# Altium schematic sheet RS485.SchDoc
size A4 portrait
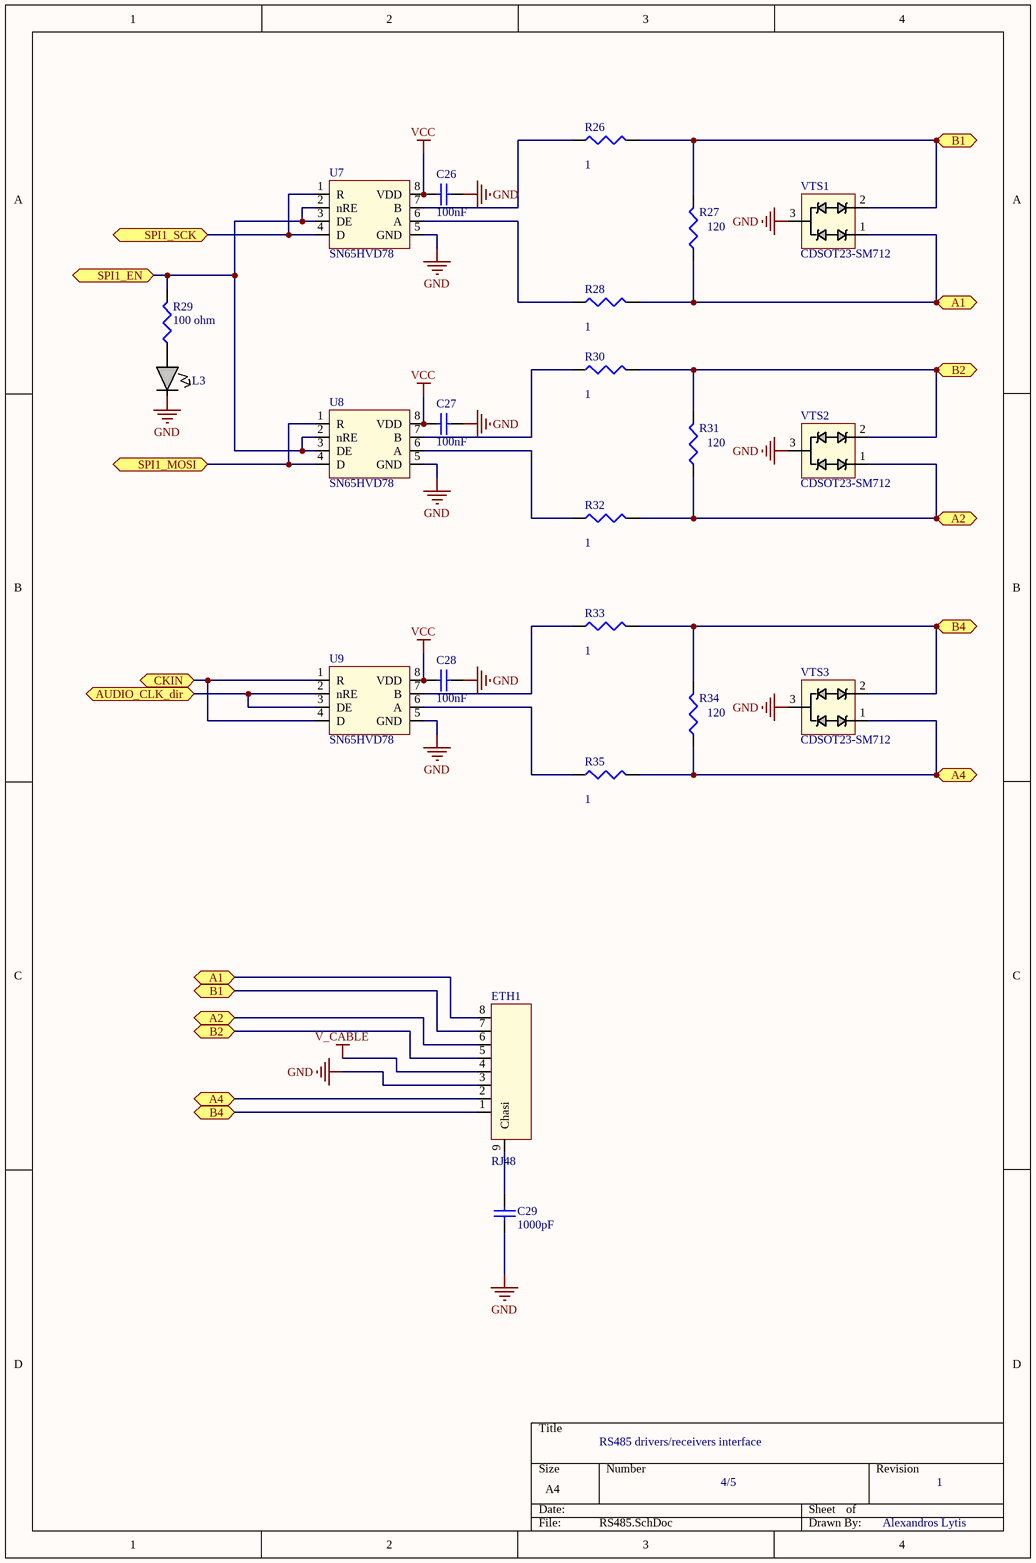
[diagram p0: RS485.SchDoc]

## Parts
C26  value 100nF  [CAP0603]  (hidden comment: Cap Semi)
C27  value 100nF  [CAP0603]  (hidden comment: Cap Semi)
C28  value 100nF  [CAP0603]  (hidden comment: Cap Semi)
C29  value 1000pF  [CAP0603]  (hidden comment: Cap Semi)
ETH1  RJ48  [TE modular Jack RJ45]
L3  LED_1.6x0.8mm  [J1-0603]  (value not drawn)
R26  value 1  [RES0603]  (hidden comment: pulse-proof)
R27  value 120  [RES0603]  (hidden comment: pulse-proof)
R28  value 1  [RES0603]  (hidden comment: pulse-proof)
R29  value 100 ohm  [RES0603]  (hidden comment: Res3)
R30  value 1  [RES0603]  (hidden comment: pulse-proof)
R31  value 120  [RES0603]  (hidden comment: pulse-proof)
R32  value 1  [RES0603]  (hidden comment: pulse-proof)
R33  value 1  [RES0603]  (hidden comment: pulse-proof)
R34  value 120  [RES0603]  (hidden comment: pulse-proof)
R35  value 1  [RES0603]  (hidden comment: pulse-proof)
U7  SN65HVD78  [SOP127P600-8N]
U8  SN65HVD78  [SOP127P600-8N]
U9  SN65HVD78  [SOP127P600-8N]
VTS1  CDSOT23-SM712  [SOT190P230X117-3N]
VTS2  CDSOT23-SM712  [SOT190P230X117-3N]
VTS3  CDSOT23-SM712  [SOT190P230X117-3N]

## Ports
A1, A2, A4, AUDIO_CLK_dir, B1, B2, B4, CKIN, SPI1_EN, SPI1_MOSI, SPI1_SCK

## Nets
GND: C26.2 C27.2 C28.2 C29.1 ETH1.3 L3.2 U7.5(GND) U8.5(GND) U9.5(GND) VTS1.3 VTS2.3 VTS3.3
V_CABLE: ETH1.4
VCC: C26.1 C27.1 C28.1 U7.8(VDD) U8.8(VDD) U9.8(VDD)
A1: ETH1.8 R27.1 R28.2 VTS1.1 ; port A1
A2: ETH1.6 R31.1 R32.2 VTS2.1 ; port A2
A4: ETH1.2 R34.1 R35.2 VTS3.1 ; port A4
AUDIO_CLK_dir: U9.2(nRE) U9.3(DE) ; port AUDIO_CLK_dir
B1: ETH1.7 R26.2 R27.2 VTS1.2 ; port B1
B2: ETH1.5 R30.2 R31.2 VTS2.2 ; port B2
B4: ETH1.1 R33.2 R34.2 VTS3.2 ; port B4
CKIN: U9.1(R) U9.4(D) ; port CKIN
SPI1_EN: R29.2 U7.2(nRE) U7.3(DE) U8.2(nRE) U8.3(DE) ; port SPI1_EN
SPI1_MOSI: U8.1(R) U8.4(D) ; port SPI1_MOSI
SPI1_SCK: U7.1(R) U7.4(D) ; port SPI1_SCK
NetC29_2: C29.2 ETH1.9(Chasi)
NetL3_1: L3.1 R29.1
NetR26_1: R26.1 U7.7(B)
NetR28_1: R28.1 U7.6(A)
NetR30_1: R30.1 U8.7(B)
NetR32_1: R32.1 U8.6(A)
NetR33_1: R33.1 U9.7(B)
NetR35_1: R35.1 U9.6(A)

## Notes on the sheet
- RS485 drivers/receivers interface
- 4/5
- 1
- Alexandros Lytis

## Library data of the parts
C26-C29 = Cap Semi: Capacitor (Semiconductor SIM Model); Published: 8-Jun-2000; LatestRevisionDate: 29-May-2009; LatestRevisionNote: IPC-7351 Footprint Added.; PackageReference: C1206; Publisher: Altium Limited; PackageDescription: Chip Capacitor
ETH1 = Ethernet Jack
R26-R35 = Res3: Resistor; Published: 8-Jun-2000; LatestRevisionDate: 29-May-2009; LatestRevisionNote: IPC-7351 Footprint Added.; PackageReference: J1-0603; Publisher: Altium Limited; PackageDescription: Chip Resistor
U7-U9 = sn65hvd7x